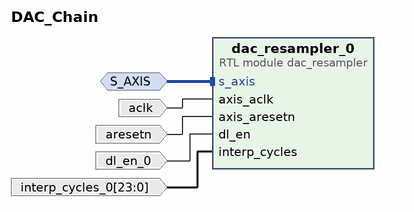
[diagram p0: block diagram of the top level]
# Vivado block design DAC_Chain, xc7z010clg400-1, Vivado 2022.1
create_bd_design DAC_Chain

create_bd_intf_port -mode Slave -vlnv xilinx.com:interface:axis_rtl:1.0 S_AXIS
set_property -dict [list \
  CONFIG.HAS_TKEEP 0 \
  CONFIG.HAS_TLAST 1 \
  CONFIG.HAS_TREADY 1 \
  CONFIG.HAS_TSTRB 0 \
  CONFIG.LAYERED_METADATA undef \
  CONFIG.TDATA_NUM_BYTES 4 \
  CONFIG.TDEST_WIDTH 0 \
  CONFIG.TID_WIDTH 0 \
  CONFIG.TUSER_WIDTH 0 \
] [get_bd_intf_ports S_AXIS]
create_bd_port -dir I -type clk aclk
create_bd_port -dir I -type rst aresetn
create_bd_port -dir I dl_en_0
create_bd_port -dir I -from 23 -to 0 interp_cycles_0

create_bd_cell -type module -reference dac_resampler dac_resampler_0

# ---- connections ----

connect_bd_intf_net -intf_net s_axis_0_1 [get_bd_intf_ports S_AXIS] [get_bd_intf_pins dac_resampler_0/s_axis]
connect_bd_net -net axis_aclk_0_1 [get_bd_ports aclk] [get_bd_pins dac_resampler_0/axis_aclk]
connect_bd_net -net axis_aresetn_0_1 [get_bd_ports aresetn] [get_bd_pins dac_resampler_0/axis_aresetn]
connect_bd_net -net dl_en_0_1 [get_bd_ports dl_en_0] [get_bd_pins dac_resampler_0/dl_en]
connect_bd_net -net interp_cycles_0_1 [get_bd_ports interp_cycles_0] [get_bd_pins dac_resampler_0/interp_cycles]

validate_bd_design
save_bd_design
